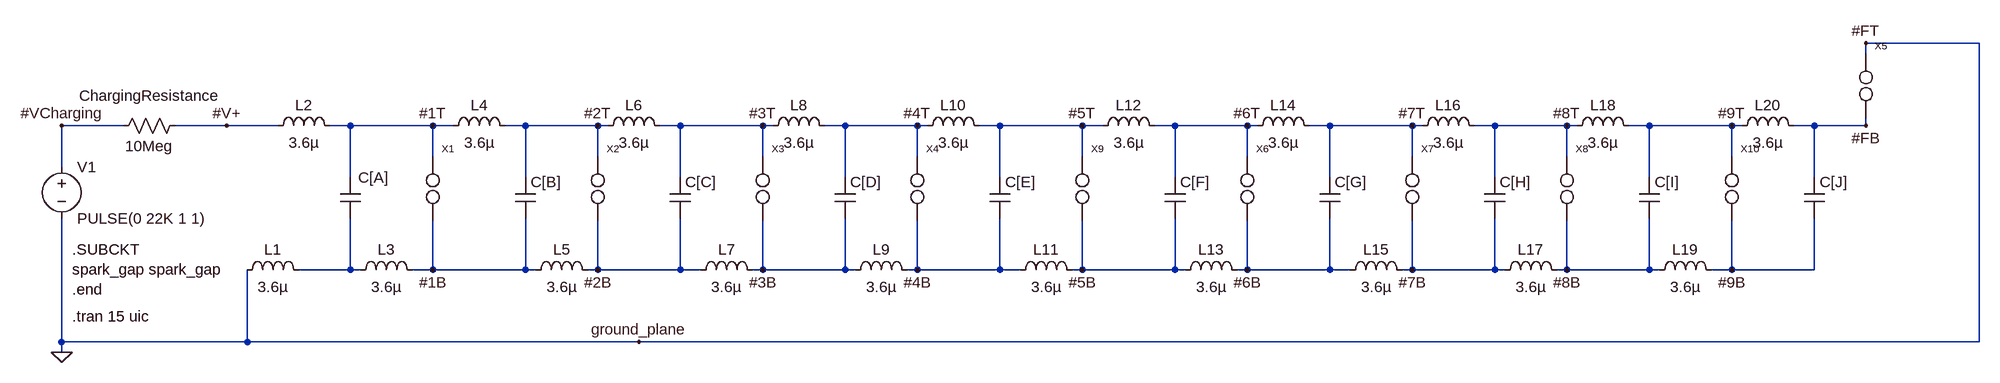
[diagram p0: schematic marx-web spark gaps.asc]
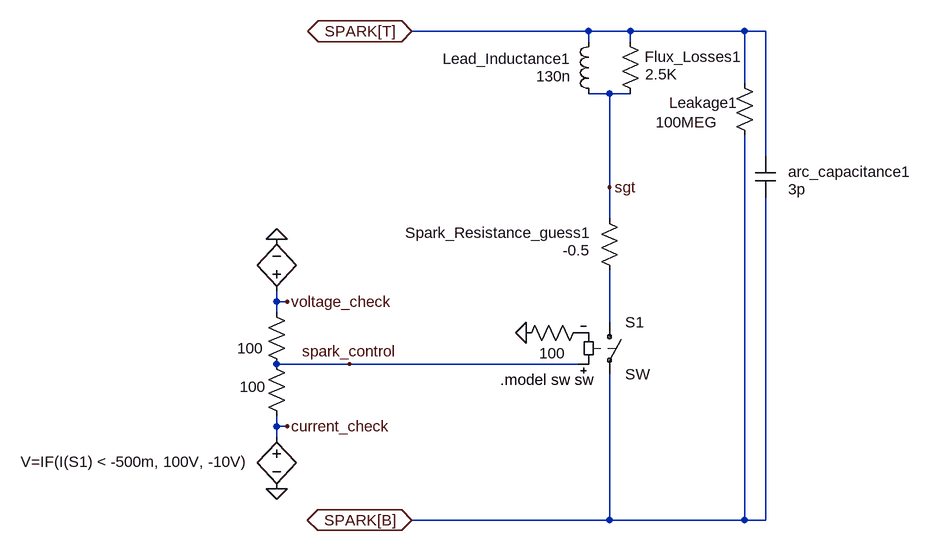
[diagram p1: sub-circuit spark_gap.asc]
marx-web spark gaps.asc, the LTspice schematic file:
Version 4
SHEET 1 1780 680
WIRE 1760 -208 1584 -208
WIRE 1584 -192 1584 -208
WIRE -1120 -80 -1216 -80
WIRE -960 -80 -1040 -80
WIRE -880 -80 -960 -80
WIRE -768 -80 -800 -80
WIRE -640 -80 -768 -80
WIRE -608 -80 -640 -80
WIRE -496 -80 -528 -80
WIRE -384 -80 -496 -80
WIRE -368 -80 -384 -80
WIRE -256 -80 -288 -80
WIRE -128 -80 -256 -80
WIRE -112 -80 -128 -80
WIRE 0 -80 -32 -80
WIRE 112 -80 0 -80
WIRE 128 -80 112 -80
WIRE 240 -80 208 -80
WIRE 368 -80 240 -80
WIRE 400 -80 368 -80
WIRE 512 -80 480 -80
WIRE 624 -80 512 -80
WIRE 640 -80 624 -80
WIRE 752 -80 720 -80
WIRE 880 -80 752 -80
WIRE 896 -80 880 -80
WIRE 1008 -80 976 -80
WIRE 1120 -80 1008 -80
WIRE 1136 -80 1120 -80
WIRE 1248 -80 1216 -80
WIRE 1376 -80 1248 -80
WIRE 1392 -80 1376 -80
WIRE 1504 -80 1472 -80
WIRE 1584 -80 1584 -96
WIRE 1584 -80 1504 -80
WIRE -640 -32 -640 -80
WIRE -384 -32 -384 -80
WIRE -128 -32 -128 -80
WIRE 112 -32 112 -80
WIRE 368 -32 368 -80
WIRE 624 -32 624 -80
WIRE 880 -32 880 -80
WIRE 1120 -32 1120 -80
WIRE 1376 -32 1376 -80
WIRE -1216 -16 -1216 -80
WIRE -768 0 -768 -80
WIRE -496 0 -496 -80
WIRE -256 0 -256 -80
WIRE 0 0 0 -80
WIRE 240 0 240 -80
WIRE 512 0 512 -80
WIRE 752 0 752 -80
WIRE 1008 0 1008 -80
WIRE 1248 0 1248 -80
WIRE 1504 0 1504 -80
WIRE -768 144 -768 64
WIRE -768 144 -848 144
WIRE -752 144 -768 144
WIRE -640 144 -640 64
WIRE -640 144 -672 144
WIRE -496 144 -496 64
WIRE -496 144 -640 144
WIRE -480 144 -496 144
WIRE -384 144 -384 64
WIRE -384 144 -400 144
WIRE -256 144 -256 64
WIRE -256 144 -384 144
WIRE -224 144 -256 144
WIRE -128 144 -128 64
WIRE -128 144 -144 144
WIRE 0 144 0 64
WIRE 0 144 -128 144
WIRE 16 144 0 144
WIRE 112 144 112 64
WIRE 112 144 96 144
WIRE 240 144 240 64
WIRE 240 144 112 144
WIRE 272 144 240 144
WIRE 368 144 368 64
WIRE 368 144 352 144
WIRE 512 144 512 64
WIRE 512 144 368 144
WIRE 528 144 512 144
WIRE 624 144 624 64
WIRE 624 144 608 144
WIRE 752 144 752 64
WIRE 752 144 624 144
WIRE 784 144 752 144
WIRE 880 144 880 64
WIRE 880 144 864 144
WIRE 1008 144 1008 64
WIRE 1008 144 880 144
WIRE 1024 144 1008 144
WIRE 1120 144 1120 64
WIRE 1120 144 1104 144
WIRE 1248 144 1248 64
WIRE 1248 144 1120 144
WIRE 1264 144 1248 144
WIRE 1376 144 1376 64
WIRE 1376 144 1344 144
WIRE 1504 144 1504 64
WIRE 1504 144 1376 144
WIRE -1216 256 -1216 64
WIRE -928 256 -928 144
WIRE -928 256 -1216 256
WIRE -320 256 -928 256
WIRE 1760 256 1760 -208
WIRE 1760 256 -320 256
WIRE -1216 272 -1216 256
FLAG -1216 272 0
FLAG -640 -80 #1T
FLAG -384 -80 #2T
FLAG -1216 -80 #VCharging
FLAG -128 -80 #3T
FLAG 112 -80 #4T
FLAG 368 -80 #5T
FLAG -640 144 #1B
FLAG -384 144 #2B
FLAG -128 144 #3B
FLAG 112 144 #4B
FLAG 368 144 #5B
FLAG 1584 -208 #FT
FLAG -320 256 ground_plane
FLAG 624 -80 #6T
FLAG 880 -80 #7T
FLAG 1120 -80 #8T
FLAG 1376 -80 #9T
FLAG 624 144 #6B
FLAG 880 144 #7B
FLAG 1120 144 #8B
FLAG 1376 144 #9B
FLAG 1584 -80 #FB
FLAG -960 -80 #V+
SYMBOL voltage -1216 -32 R0
WINDOW 123 0 0 Left 2
WINDOW 39 0 0 Left 2
SYMATTR InstName V1
SYMATTR Value PULSE(0 22K 1 1)
SYMBOL ind -944 160 R270
WINDOW 0 32 56 VTop 2
WINDOW 3 5 56 VBottom 2
SYMATTR InstName L1
SYMATTR Value 3.6µ
SYMATTR SpiceLine Rser=0.83 Rpar=1000MEG
SYMBOL cap -512 0 R0
WINDOW 3 24 56 Invisible 2
SYMATTR Value 0.9n
SYMATTR InstName C[B]
SYMATTR SpiceLine V=200K
SYMBOL cap -784 0 R0
WINDOW 0 28 1 Left 2
WINDOW 3 46 62 Invisible 2
SYMATTR InstName C[A]
SYMATTR Value 0.9n
SYMATTR SpiceLine V=200K
SYMBOL cap -272 0 R0
WINDOW 3 24 56 Invisible 2
SYMATTR Value 0.9n
SYMATTR InstName C[C]
SYMATTR SpiceLine V=200K
SYMBOL cap -16 0 R0
WINDOW 3 24 56 Invisible 2
SYMATTR Value 0.9n
SYMATTR InstName C[D]
SYMATTR SpiceLine V=200K
SYMBOL res -1024 -96 R90
WINDOW 0 -15 56 VBottom 2
WINDOW 3 32 56 VTop 2
SYMATTR InstName ChargingResistance
SYMATTR Value 10Meg
SYMBOL ind -768 160 R270
WINDOW 0 32 56 VTop 2
WINDOW 3 5 56 VBottom 2
SYMATTR InstName L3
SYMATTR Value 3.6µ
SYMATTR SpiceLine Rser=0.83 Rpar=1000MEG
SYMBOL ind -624 -64 R270
WINDOW 0 32 56 VTop 2
WINDOW 3 5 56 VBottom 2
SYMATTR InstName L4
SYMATTR Value 3.6µ
SYMATTR SpiceLine Rser=0.83 Rpar=1000MEG
SYMBOL ind -496 160 R270
WINDOW 0 32 56 VTop 2
WINDOW 3 5 56 VBottom 2
SYMATTR InstName L5
SYMATTR Value 3.6µ
SYMATTR SpiceLine Rser=0.83 Rpar=1000MEG
SYMBOL ind -384 -64 R270
WINDOW 0 32 56 VTop 2
WINDOW 3 5 56 VBottom 2
SYMATTR InstName L6
SYMATTR Value 3.6µ
SYMATTR SpiceLine Rser=0.83 Rpar=1000MEG
SYMBOL ind -240 160 R270
WINDOW 0 32 56 VTop 2
WINDOW 3 5 56 VBottom 2
SYMATTR InstName L7
SYMATTR Value 3.6µ
SYMATTR SpiceLine Rser=0.83 Rpar=1000MEG
SYMBOL ind -128 -64 R270
WINDOW 0 32 56 VTop 2
WINDOW 3 5 56 VBottom 2
SYMATTR InstName L8
SYMATTR Value 3.6µ
SYMATTR SpiceLine Rser=0.83 Rpar=1000MEG
SYMBOL ind -896 -64 R270
WINDOW 0 32 56 VTop 2
WINDOW 3 5 56 VBottom 2
SYMATTR InstName L2
SYMATTR Value 3.6µ
SYMATTR SpiceLine Rser=0.83 Rpar=1000MEG
SYMBOL cap 224 0 R0
WINDOW 3 24 56 Invisible 2
SYMATTR Value 0.9n
SYMATTR InstName C[E]
SYMATTR SpiceLine V=200K
SYMBOL ind 0 160 R270
WINDOW 0 32 56 VTop 2
WINDOW 3 5 56 VBottom 2
SYMATTR InstName L9
SYMATTR Value 3.6µ
SYMATTR SpiceLine Rser=0.83 Rpar=1000MEG
SYMBOL ind 112 -64 R270
WINDOW 0 32 56 VTop 2
WINDOW 3 5 56 VBottom 2
SYMATTR InstName L10
SYMATTR Value 3.6µ
SYMATTR SpiceLine Rser=0.83 Rpar=1000MEG
SYMBOL ind 256 160 R270
WINDOW 0 32 56 VTop 2
WINDOW 3 5 56 VBottom 2
SYMATTR InstName L11
SYMATTR Value 3.6µ
SYMATTR SpiceLine Rser=10K Rpar=1000MEG
SYMBOL spark_gap -656 16 R0
SYMATTR InstName X1
SYMBOL spark_gap -400 16 R0
SYMATTR InstName X2
SYMBOL spark_gap -144 16 R0
SYMATTR InstName X3
SYMBOL spark_gap 96 16 R0
SYMATTR InstName X4
SYMBOL spark_gap 1568 -144 R0
SYMATTR InstName X5
SYMBOL cap 496 0 R0
WINDOW 3 24 56 Invisible 2
SYMATTR Value 0.9n
SYMATTR InstName C[F]
SYMATTR SpiceLine V=200K
SYMBOL cap 736 0 R0
WINDOW 3 24 56 Invisible 2
SYMATTR Value 0.9n
SYMATTR InstName C[G]
SYMATTR SpiceLine V=200K
SYMBOL cap 992 0 R0
WINDOW 3 24 56 Invisible 2
SYMATTR Value 0.9n
SYMATTR InstName C[H]
SYMATTR SpiceLine V=200K
SYMBOL ind 384 -64 R270
WINDOW 0 32 56 VTop 2
WINDOW 3 5 56 VBottom 2
SYMATTR InstName L12
SYMATTR Value 3.6µ
SYMATTR SpiceLine Rser=0.83 Rpar=1000MEG
SYMBOL ind 512 160 R270
WINDOW 0 32 56 VTop 2
WINDOW 3 5 56 VBottom 2
SYMATTR InstName L13
SYMATTR Value 3.6µ
SYMATTR SpiceLine Rser=0.83 Rpar=1000MEG
SYMBOL ind 624 -64 R270
WINDOW 0 32 56 VTop 2
WINDOW 3 5 56 VBottom 2
SYMATTR InstName L14
SYMATTR Value 3.6µ
SYMATTR SpiceLine Rser=0.83 Rpar=1000MEG
SYMBOL ind 768 160 R270
WINDOW 0 32 56 VTop 2
WINDOW 3 5 56 VBottom 2
SYMATTR InstName L15
SYMATTR Value 3.6µ
SYMATTR SpiceLine Rser=0.83 Rpar=1000MEG
SYMBOL ind 880 -64 R270
WINDOW 0 32 56 VTop 2
WINDOW 3 5 56 VBottom 2
SYMATTR InstName L16
SYMATTR Value 3.6µ
SYMATTR SpiceLine Rser=0.83 Rpar=1000MEG
SYMBOL cap 1232 0 R0
WINDOW 3 24 56 Invisible 2
SYMATTR Value 0.9n
SYMATTR InstName C[I]
SYMATTR SpiceLine V=200K
SYMBOL ind 1008 160 R270
WINDOW 0 32 56 VTop 2
WINDOW 3 5 56 VBottom 2
SYMATTR InstName L17
SYMATTR Value 3.6µ
SYMATTR SpiceLine Rser=0.83 Rpar=1000MEG
SYMBOL ind 1120 -64 R270
WINDOW 0 32 56 VTop 2
WINDOW 3 5 56 VBottom 2
SYMATTR InstName L18
SYMATTR Value 3.6µ
SYMATTR SpiceLine Rser=0.83 Rpar=1000MEG
SYMBOL spark_gap 608 16 R0
SYMATTR InstName X6
SYMBOL spark_gap 864 16 R0
SYMATTR InstName X7
SYMBOL spark_gap 1104 16 R0
SYMATTR InstName X8
SYMBOL spark_gap 352 16 R0
SYMATTR InstName X9
SYMBOL cap 1488 0 R0
WINDOW 3 24 56 Invisible 2
SYMATTR Value 0.9n
SYMATTR InstName C[J]
SYMATTR SpiceLine V=200K
SYMBOL ind 1248 160 R270
WINDOW 0 32 56 VTop 2
WINDOW 3 5 56 VBottom 2
SYMATTR InstName L19
SYMATTR Value 3.6µ
SYMATTR SpiceLine Rser=0.83 Rpar=1000MEG
SYMBOL spark_gap 1360 16 R0
SYMATTR InstName X10
SYMBOL ind 1376 -64 R270
WINDOW 0 32 56 VTop 2
WINDOW 3 5 56 VBottom 2
SYMATTR InstName L20
SYMATTR Value 3.6µ
SYMATTR SpiceLine Rser=0.83 Rpar=1000MEG
TEXT -1200 216 Left 2 !.tran 15 uic
TEXT -1200 112 Left 2 !.SUBCKT \nspark_gap spark_gap\n.end

spark_gap.asc, the sub-circuit schematic file:
Version 4
SHEET 1 2128 820
WIRE 192 -144 -80 -144
WIRE 256 -144 192 -144
WIRE 432 -144 256 -144
WIRE 464 -144 432 -144
WIRE 192 -128 192 -144
WIRE 256 -128 256 -144
WIRE 432 -64 432 -144
WIRE 224 -48 192 -48
WIRE 256 -48 224 -48
WIRE 464 48 464 -144
WIRE 224 96 224 -48
WIRE 224 144 224 96
WIRE -288 272 -288 256
WIRE -272 272 -288 272
WIRE -288 288 -288 272
WIRE 224 304 224 224
WIRE -176 368 -288 368
WIRE 176 368 -176 368
WIRE -288 464 -288 448
WIRE -272 464 -288 464
WIRE -288 480 -288 464
WIRE 224 608 224 384
WIRE 224 608 -80 608
WIRE 432 608 432 16
WIRE 432 608 224 608
WIRE 464 608 464 112
WIRE 464 608 432 608
FLAG -80 -144 SPARK[T]
IOPIN -80 -144 BiDir
FLAG -80 608 SPARK[B]
IOPIN -80 608 BiDir
FLAG -288 176 0
FLAG -288 560 0
FLAG 96 320 0
FLAG -272 272 voltage_check
FLAG -272 464 current_check
FLAG -176 368 spark_control
FLAG 224 96 sgt
SYMBOL bv -288 464 R0
WINDOW 0 24 16 Invisible 2
WINDOW 3 -42 54 Right 2
SYMATTR InstName B1
SYMATTR Value V=IF(I(S1) < -500m, 100V, -10V)
SYMBOL bv -288 272 R180
WINDOW 0 24 96 Invisible 2
WINDOW 3 42 56 Left 2
SYMATTR InstName B2
SYMATTR Value ""
SYMBOL sw 224 288 R0
SYMATTR InstName S1
SYMBOL res 416 -80 R0
WINDOW 0 -100 46 Left 2
WINDOW 3 -121 76 Left 2
SYMATTR InstName Leakage1
SYMATTR Value 100MEG
SYMBOL res 240 -144 R0
WINDOW 0 38 39 Left 2
WINDOW 3 39 66 Left 2
SYMATTR InstName Flux_Losses1
SYMATTR Value 2.5K
SYMBOL res 208 128 R0
WINDOW 0 -11 38 Right 2
WINDOW 3 -14 65 Right 2
SYMATTR InstName Spark_Resistance_guess1
SYMATTR Value -0.5
SYMBOL ind 208 -32 R180
WINDOW 0 41 70 Left 2
WINDOW 3 43 43 Left 2
SYMATTR InstName Lead_Inductance1
SYMATTR Value 130n
SYMBOL cap 448 48 R0
WINDOW 0 51 24 Left 2
WINDOW 3 51 51 Left 2
SYMATTR InstName arc_capacitance1
SYMATTR Value 3p
SYMBOL res -272 384 R180
WINDOW 0 36 76 Invisible 2
WINDOW 3 36 40 Left 2
SYMATTR InstName R1
SYMATTR Value 100
SYMBOL res -304 352 R0
WINDOW 0 -34 43 Invisible 2
WINDOW 3 -41 51 Left 2
SYMATTR InstName R2
SYMATTR Value 100
SYMBOL res 80 336 R270
WINDOW 0 32 56 Invisible 2
WINDOW 3 0 56 VBottom 2
SYMATTR InstName R3
SYMATTR Value 100
TEXT 56 392 Left 2 !.model sw sw

The netlist it stands for:
* marx-web spark gaps.asc
V1 #VCharging 0 PULSE(0 22K 1 1)
L1 0 N001 3.6µ Rser=0.83 Rpar=1000MEG
C[B] #2T #1B 0.9n V=200K
C[A] #1T N001 0.9n V=200K
C[C] #3T #2B 0.9n V=200K
C[D] #4T #3B 0.9n V=200K
R§ChargingResistance #V+ #VCharging 10Meg
L3 N001 #1B 3.6µ Rser=0.83 Rpar=1000MEG
L4 #1T #2T 3.6µ Rser=0.83 Rpar=1000MEG
L5 #1B #2B 3.6µ Rser=0.83 Rpar=1000MEG
L6 #2T #3T 3.6µ Rser=0.83 Rpar=1000MEG
L7 #2B #3B 3.6µ Rser=0.83 Rpar=1000MEG
L8 #3T #4T 3.6µ Rser=0.83 Rpar=1000MEG
L2 #V+ #1T 3.6µ Rser=0.83 Rpar=1000MEG
C[E] #5T #4B 0.9n V=200K
L9 #3B #4B 3.6µ Rser=0.83 Rpar=1000MEG
L10 #4T #5T 3.6µ Rser=0.83 Rpar=1000MEG
L11 #4B #5B 3.6µ Rser=10K Rpar=1000MEG
XX1 #1T #1B spark_gap
XX2 #2T #2B spark_gap
XX3 #3T #3B spark_gap
XX4 #4T #4B spark_gap
XX5 0 #FB spark_gap
C[F] #6T #5B 0.9n V=200K
C[G] #7T #6B 0.9n V=200K
C[H] #8T #7B 0.9n V=200K
L12 #5T #6T 3.6µ Rser=0.83 Rpar=1000MEG
L13 #5B #6B 3.6µ Rser=0.83 Rpar=1000MEG
L14 #6T #7T 3.6µ Rser=0.83 Rpar=1000MEG
L15 #6B #7B 3.6µ Rser=0.83 Rpar=1000MEG
L16 #7T #8T 3.6µ Rser=0.83 Rpar=1000MEG
C[I] #9T #8B 0.9n V=200K
L17 #7B #8B 3.6µ Rser=0.83 Rpar=1000MEG
L18 #8T #9T 3.6µ Rser=0.83 Rpar=1000MEG
XX6 #6T #6B spark_gap
XX7 #7T #7B spark_gap
XX8 #8T #8B spark_gap
XX9 #5T #5B spark_gap
C[J] #FB #9B 0.9n V=200K
L19 #8B #9B 3.6µ Rser=0.83 Rpar=1000MEG
XX10 #9T #9B spark_gap
L20 #9T #FB 3.6µ Rser=0.83 Rpar=1000MEG

* block symbol definitions
.subckt spark_gap SPARK[T] SPARK[B]
B1 current_check 0 V=IF(I(S1) < -500m, 100V, -10V)
B2 voltage_check 0
S1 N001 SPARK[B] spark_control P001 SW
R§Leakage1 SPARK[T] SPARK[B] 100MEG
R§Flux_Losses1 SPARK[T] sgt 2.5K
R§Spark_Resistance_guess1 sgt N001 -0.5
Lead_Inductance1 sgt SPARK[T] 130n
C§arc_capacitance1 SPARK[T] SPARK[B] 3p
R1 spark_control voltage_check 100
R2 spark_control current_check 100
R3 0 P001 100
.model sw sw
.ends spark_gap

.tran 15 uic
.SUBCKT
spark_gap spark_gap
.end
.backanno
.end